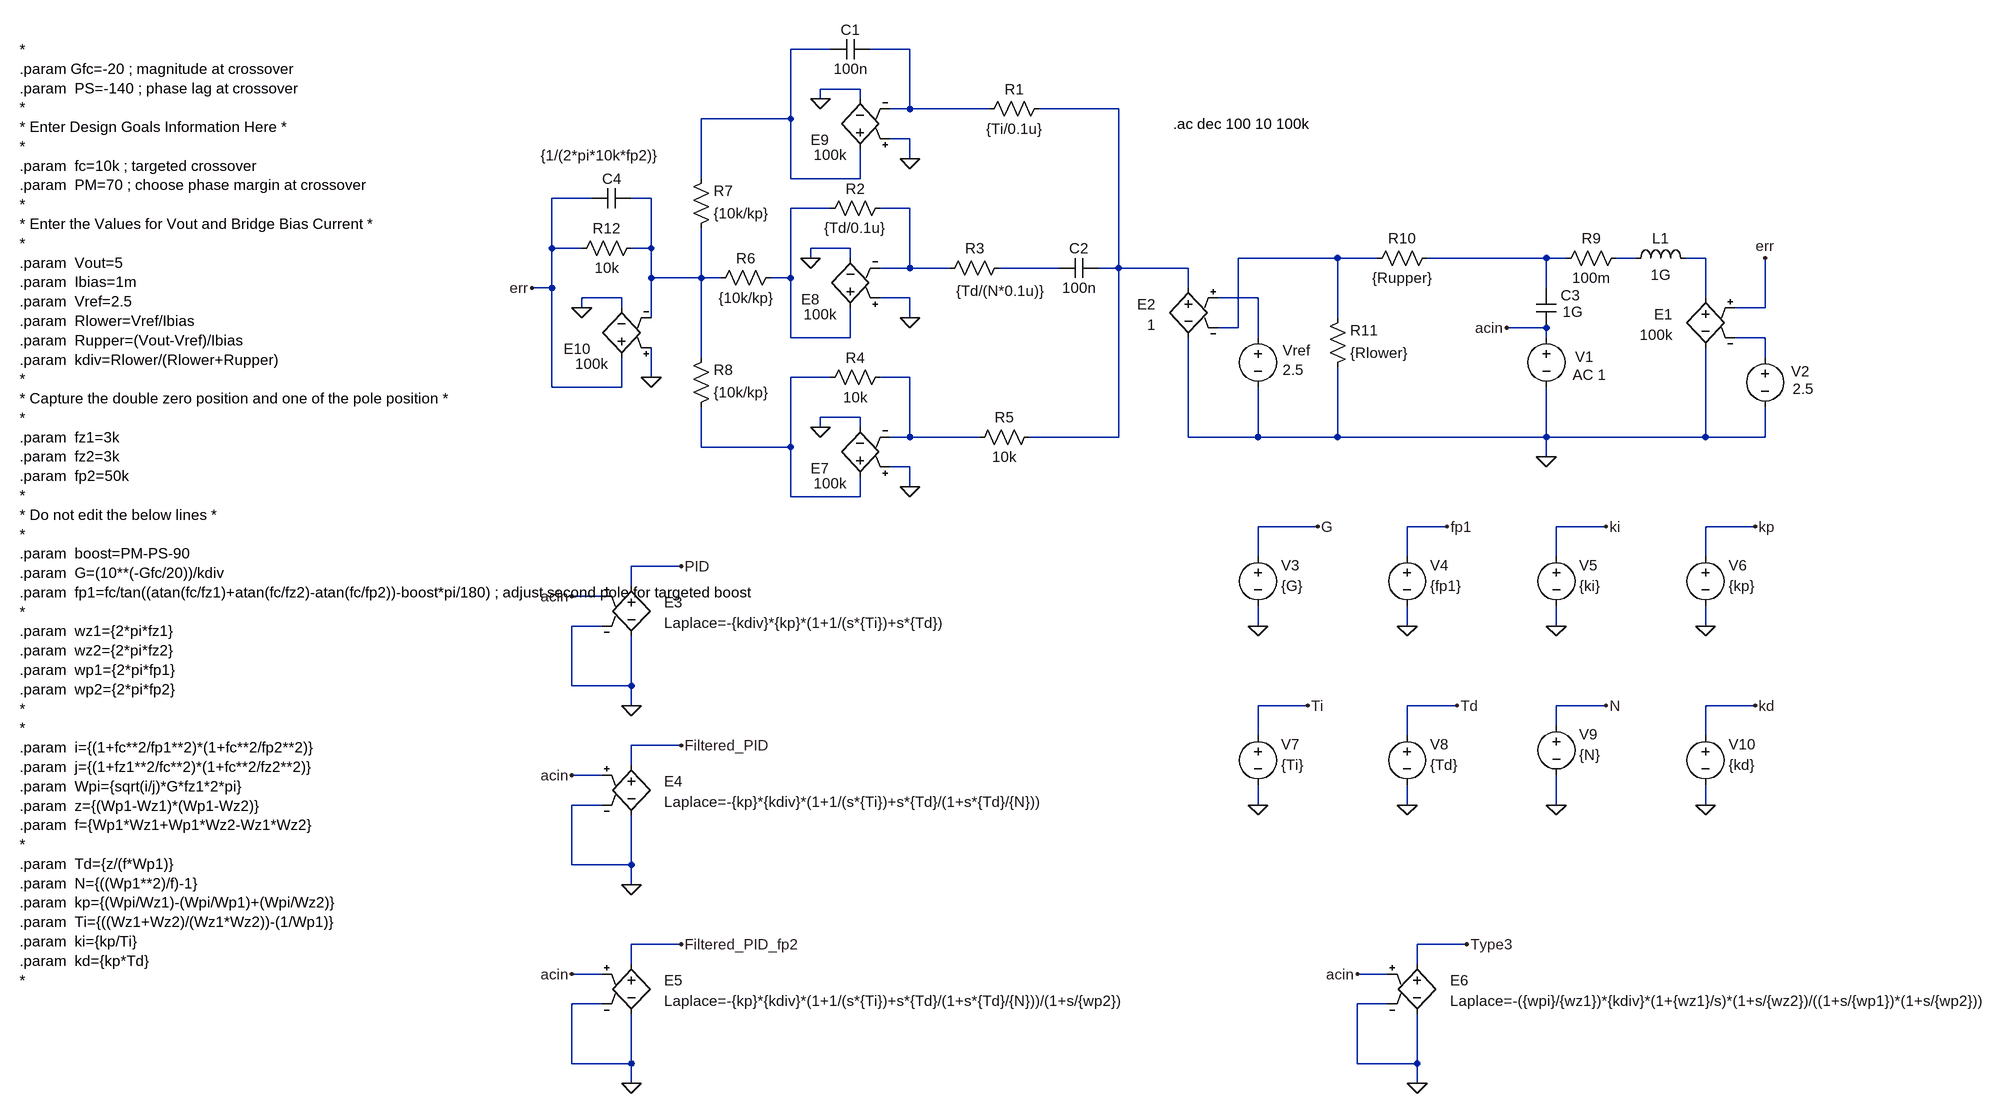
[diagram p0: schematic Filtered PID - E sources.asc]
Filtered PID - E sources.asc, the LTspice schematic file:
Version 4
SHEET 1 2344 2244
WIRE 256 -144 192 -144
WIRE 384 -144 320 -144
WIRE 304 -80 240 -80
WIRE 240 -64 240 -80
WIRE 304 -64 304 -80
WIRE 384 -48 384 -144
WIRE 384 -48 352 -48
WIRE 512 -48 384 -48
WIRE 720 -48 592 -48
WIRE 192 -32 192 -144
WIRE 192 -32 48 -32
WIRE 384 0 352 0
WIRE 384 32 384 0
WIRE 48 64 48 -32
WIRE 192 64 192 -32
WIRE 304 64 304 16
WIRE 304 64 192 64
WIRE -128 96 -192 96
WIRE -32 96 -64 96
WIRE 256 112 192 112
WIRE 384 112 336 112
WIRE -192 176 -192 96
WIRE -144 176 -192 176
WIRE -32 176 -32 96
WIRE -32 176 -64 176
WIRE 288 176 224 176
WIRE 224 192 224 176
WIRE 288 192 288 176
WIRE 1072 192 912 192
WIRE 1136 192 1072 192
WIRE 1408 192 1216 192
WIRE 1440 192 1408 192
WIRE 1552 192 1520 192
WIRE 1664 192 1632 192
WIRE 384 208 384 112
WIRE 384 208 336 208
WIRE 448 208 384 208
WIRE 624 208 528 208
WIRE 720 208 720 -48
WIRE 720 208 688 208
WIRE 832 208 720 208
WIRE -32 224 -32 176
WIRE 48 224 48 144
WIRE 48 224 -32 224
WIRE 80 224 48 224
WIRE 192 224 192 112
WIRE 192 224 160 224
WIRE -192 240 -192 176
WIRE -192 240 -224 240
WIRE 832 240 832 208
WIRE 1408 240 1408 192
WIRE -80 256 -144 256
WIRE 384 256 336 256
WIRE 944 256 880 256
WIRE 1664 256 1664 192
WIRE -144 272 -144 256
WIRE -80 272 -80 256
WIRE 1760 272 1760 192
WIRE 1760 272 1712 272
WIRE -32 288 -32 224
WIRE 384 288 384 256
WIRE 1072 288 1072 192
WIRE 912 304 912 192
WIRE 912 304 880 304
WIRE 1408 304 1344 304
WIRE 192 320 192 224
WIRE 288 320 288 272
WIRE 288 320 192 320
WIRE 944 320 944 256
WIRE 1408 320 1408 304
WIRE 1760 320 1712 320
WIRE 48 352 48 224
WIRE 1760 352 1760 320
WIRE -32 384 -32 336
WIRE 256 384 192 384
WIRE 384 384 336 384
WIRE -192 400 -192 240
WIRE -80 400 -80 352
WIRE -80 400 -192 400
WIRE 304 448 240 448
WIRE 240 464 240 448
WIRE 304 464 304 448
WIRE 384 480 384 384
WIRE 384 480 352 480
WIRE 496 480 384 480
WIRE 720 480 720 208
WIRE 720 480 576 480
WIRE 832 480 832 320
WIRE 944 480 944 400
WIRE 944 480 832 480
WIRE 1072 480 1072 368
WIRE 1072 480 944 480
WIRE 1408 480 1408 400
WIRE 1408 480 1072 480
WIRE 1664 480 1664 336
WIRE 1664 480 1408 480
WIRE 1760 480 1760 432
WIRE 1760 480 1664 480
WIRE 48 496 48 432
WIRE 192 496 192 384
WIRE 192 496 48 496
WIRE 1408 512 1408 480
WIRE 384 528 352 528
WIRE 384 560 384 528
WIRE 192 576 192 496
WIRE 304 576 304 544
WIRE 304 576 192 576
WIRE 1040 624 944 624
WIRE 1248 624 1184 624
WIRE 1504 624 1424 624
WIRE 1744 624 1664 624
WIRE 944 672 944 624
WIRE 1184 672 1184 624
WIRE 1424 672 1424 624
WIRE 1664 672 1664 624
WIRE 16 688 -64 688
WIRE -64 720 -64 688
WIRE -112 736 -160 736
WIRE -112 784 -160 784
WIRE 944 784 944 752
WIRE 1184 784 1184 752
WIRE 1424 784 1424 752
WIRE 1664 784 1664 752
WIRE -160 880 -160 784
WIRE -64 880 -64 800
WIRE -64 880 -160 880
WIRE -64 912 -64 880
WIRE 1024 912 944 912
WIRE 1264 912 1184 912
WIRE 1504 912 1424 912
WIRE 1744 912 1664 912
WIRE 1424 944 1424 912
WIRE 944 960 944 912
WIRE 1184 960 1184 912
WIRE 1664 960 1664 912
WIRE 16 976 -64 976
WIRE -64 1008 -64 976
WIRE -112 1024 -160 1024
WIRE -112 1072 -160 1072
WIRE 944 1072 944 1040
WIRE 1184 1072 1184 1040
WIRE 1424 1072 1424 1024
WIRE 1664 1072 1664 1040
WIRE -160 1168 -160 1072
WIRE -64 1168 -64 1088
WIRE -64 1168 -160 1168
WIRE -64 1200 -64 1168
WIRE 16 1296 -64 1296
WIRE 1280 1296 1200 1296
WIRE -64 1328 -64 1296
WIRE 1200 1328 1200 1296
WIRE -112 1344 -160 1344
WIRE 1152 1344 1104 1344
WIRE -112 1392 -160 1392
WIRE 1152 1392 1104 1392
WIRE -160 1488 -160 1392
WIRE -64 1488 -64 1408
WIRE -64 1488 -160 1488
WIRE 1104 1488 1104 1392
WIRE 1200 1488 1200 1408
WIRE 1200 1488 1104 1488
WIRE -64 1520 -64 1488
WIRE 1200 1520 1200 1488
FLAG -224 240 err
FLAG 1760 192 err
FLAG 1408 512 0
FLAG 1040 624 G
FLAG 944 784 0
FLAG 1248 624 fp1
FLAG 1184 784 0
FLAG 1504 624 ki
FLAG 1424 784 0
FLAG 1744 624 kp
FLAG 1664 784 0
FLAG 1024 912 Ti
FLAG 944 1072 0
FLAG 1264 912 Td
FLAG 1184 1072 0
FLAG 1504 912 N
FLAG 1424 1072 0
FLAG 1744 912 kd
FLAG 1664 1072 0
FLAG 1344 304 acin
FLAG -64 912 0
FLAG 16 688 PID
FLAG -160 736 acin
FLAG -64 1200 0
FLAG 16 976 Filtered_PID
FLAG -160 1024 acin
FLAG -64 1520 0
FLAG 16 1296 Filtered_PID_fp2
FLAG -160 1344 acin
FLAG 1200 1520 0
FLAG 1280 1296 Type3
FLAG 1104 1344 acin
FLAG 240 464 0
FLAG 384 560 0
FLAG 224 192 0
FLAG 240 -64 0
FLAG -144 272 0
FLAG -32 384 0
FLAG 384 32 0
FLAG 384 288 0
DATAFLAG 1328 192 ""
DATAFLAG 944 624 ""
DATAFLAG 1184 624 ""
DATAFLAG 1424 624 ""
DATAFLAG 1664 624 ""
DATAFLAG 976 912 ""
DATAFLAG 1184 912 ""
DATAFLAG 1456 912 ""
DATAFLAG 1664 912 ""
SYMBOL cap 320 -160 R90
WINDOW 0 0 32 VBottom 2
WINDOW 3 32 32 VTop 2
SYMATTR InstName C1
SYMATTR Value 100n
SYMBOL res 608 -64 R90
WINDOW 0 0 56 VBottom 2
WINDOW 3 32 56 VTop 2
SYMATTR InstName R1
SYMATTR Value {Ti/0.1u}
SYMBOL res 352 96 R90
WINDOW 0 0 56 VBottom 2
WINDOW 3 32 56 VTop 2
SYMATTR InstName R2
SYMATTR Value {Td/0.1u}
SYMBOL res 544 192 R90
WINDOW 0 0 56 VBottom 2
WINDOW 3 37 15 VTop 2
SYMATTR InstName R3
SYMATTR Value {Td/(N*0.1u)}
SYMBOL cap 688 192 R90
WINDOW 0 0 32 VBottom 2
WINDOW 3 32 32 VTop 2
SYMATTR InstName C2
SYMATTR Value 100n
SYMBOL res 352 368 R90
WINDOW 0 0 56 VBottom 2
WINDOW 3 32 56 VTop 2
SYMATTR InstName R4
SYMATTR Value 10k
SYMBOL res 592 464 R90
WINDOW 0 0 56 VBottom 2
WINDOW 3 32 56 VTop 2
SYMATTR InstName R5
SYMATTR Value 10k
SYMBOL res 176 208 R90
WINDOW 0 0 56 VBottom 2
WINDOW 3 32 56 VTop 2
SYMATTR InstName R6
SYMATTR Value {10k/kp}
SYMBOL res 32 160 M180
WINDOW 0 36 76 Left 2
WINDOW 3 36 40 Left 2
SYMATTR InstName R7
SYMATTR Value {10k/kp}
SYMBOL res 32 448 M180
WINDOW 0 36 76 Left 2
WINDOW 3 36 40 Left 2
SYMATTR InstName R8
SYMATTR Value {10k/kp}
SYMBOL voltage 944 304 R0
WINDOW 0 40 36 Left 2
WINDOW 3 40 68 Left 2
SYMATTR InstName Vref
SYMATTR Value 2.5
SYMBOL e 1664 240 M0
WINDOW 0 53 42 Left 2
WINDOW 3 53 75 Left 2
SYMATTR InstName E1
SYMATTR Value 100k
SYMBOL ind 1536 208 R270
WINDOW 0 32 56 VTop 2
WINDOW 3 5 56 VBottom 2
SYMATTR InstName L1
SYMATTR Value 1G
SYMBOL res 1536 176 R90
WINDOW 0 0 56 VBottom 2
WINDOW 3 32 56 VTop 2
SYMATTR InstName R9
SYMATTR Value 100m
SYMBOL cap 1392 240 R0
WINDOW 0 39 12 Left 2
WINDOW 3 42 38 Left 2
SYMATTR InstName C3
SYMATTR Value 1G
SYMBOL voltage 1408 304 R0
WINDOW 0 46 47 Left 2
WINDOW 123 42 76 Left 2
WINDOW 39 0 0 Left 0
SYMATTR InstName V1
SYMATTR Value2 AC 1
SYMATTR Value ""
SYMBOL voltage 1760 336 R0
WINDOW 0 42 38 Left 2
WINDOW 3 44 66 Left 2
SYMATTR InstName V2
SYMATTR Value 2.5
SYMBOL res 1232 176 R90
WINDOW 0 0 56 VBottom 2
WINDOW 3 32 56 VTop 2
SYMATTR InstName R10
SYMATTR Value {Rupper}
SYMBOL res 1056 384 M180
WINDOW 0 36 76 Left 2
WINDOW 3 36 40 Left 2
SYMATTR InstName R11
SYMATTR Value {Rlower}
SYMBOL voltage 944 656 R0
WINDOW 0 37 30 Left 2
WINDOW 3 37 63 Left 2
SYMATTR InstName V3
SYMATTR Value {G}
SYMBOL voltage 1184 656 R0
WINDOW 0 37 30 Left 2
WINDOW 3 37 63 Left 2
SYMATTR InstName V4
SYMATTR Value {fp1}
SYMBOL voltage 1424 656 R0
WINDOW 0 37 30 Left 2
WINDOW 3 37 63 Left 2
SYMATTR InstName V5
SYMATTR Value {ki}
SYMBOL voltage 1664 656 R0
WINDOW 0 37 30 Left 2
WINDOW 3 37 63 Left 2
SYMATTR InstName V6
SYMATTR Value {kp}
SYMBOL voltage 944 944 R0
WINDOW 0 37 30 Left 2
WINDOW 3 37 63 Left 2
SYMATTR InstName V7
SYMATTR Value {Ti}
SYMBOL voltage 1184 944 R0
WINDOW 0 37 30 Left 2
WINDOW 3 37 63 Left 2
SYMATTR InstName V8
SYMATTR Value {Td}
SYMBOL voltage 1424 928 R0
WINDOW 0 37 30 Left 2
WINDOW 3 37 63 Left 2
SYMATTR InstName V9
SYMATTR Value {N}
SYMBOL res -48 160 R90
WINDOW 0 0 56 VBottom 2
WINDOW 3 32 56 VTop 2
SYMATTR InstName R12
SYMATTR Value 10k
SYMBOL cap -64 80 R90
WINDOW 0 0 32 VBottom 2
WINDOW 3 -69 53 VTop 2
SYMATTR InstName C4
SYMATTR Value {1/(2*pi*10k*fp2)}
SYMBOL voltage 1664 944 R0
WINDOW 0 37 30 Left 2
WINDOW 3 37 63 Left 2
SYMATTR InstName V10
SYMATTR Value {kd}
SYMBOL e 832 224 M0
WINDOW 0 53 42 Left 2
WINDOW 3 53 75 Left 2
SYMATTR InstName E2
SYMATTR Value 1
SYMBOL e -64 704 R0
WINDOW 0 53 42 Left 2
WINDOW 3 53 75 Left 2
SYMATTR InstName E3
SYMATTR Value Laplace=-{kdiv}*{kp}*(1+1/(s*{Ti})+s*{Td})
SYMBOL e -64 992 R0
WINDOW 0 53 42 Left 2
WINDOW 3 53 75 Left 2
SYMATTR InstName E4
SYMATTR Value Laplace=-{kp}*{kdiv}*(1+1/(s*{Ti})+s*{Td}/(1+s*{Td}/{N}))
SYMBOL e -64 1312 R0
WINDOW 0 53 42 Left 2
WINDOW 3 53 75 Left 2
SYMATTR InstName E5
SYMATTR Value Laplace=-{kp}*{kdiv}*(1+1/(s*{Ti})+s*{Td}/(1+s*{Td}/{N}))/(1+s/{wp2})
SYMBOL e 1200 1312 R0
WINDOW 0 53 42 Left 2
WINDOW 3 53 75 Left 2
SYMATTR InstName E6
SYMATTR Value Laplace=-({wpi}/{wz1})*{kdiv}*(1+{wz1}/s)*(1+s/{wz2})/((1+s/{wp1})*(1+s/{wp2}))
SYMBOL e 304 560 R180
WINDOW 0 50 30 Left 2
WINDOW 3 22 6 Left 2
SYMATTR InstName E7
SYMATTR Value 100k
SYMBOL e 288 288 R180
WINDOW 0 50 30 Left 2
WINDOW 3 22 6 Left 2
SYMATTR InstName E8
SYMATTR Value 100k
SYMBOL e 304 32 R180
WINDOW 0 50 30 Left 2
WINDOW 3 22 6 Left 2
SYMATTR InstName E9
SYMATTR Value 100k
SYMBOL e -80 368 R180
WINDOW 0 50 30 Left 2
WINDOW 3 22 6 Left 2
SYMATTR InstName E10
SYMATTR Value 100k
TEXT -1048 -144 Left 2 !*\n.param Gfc=-20 ; magnitude at crossover\n.param  PS=-140 ; phase lag at crossover\n*\n* Enter Design Goals Information Here *\n*\n.param  fc=10k ; targeted crossover\n.param  PM=70 ; choose phase margin at crossover\n*\n* Enter the Values for Vout and Bridge Bias Current *\n*\n.param  Vout=5\n.param  Ibias=1m\n.param  Vref=2.5\n.param  Rlower=Vref/Ibias\n.param  Rupper=(Vout-Vref)/Ibias\n.param  kdiv=Rlower/(Rlower+Rupper)\n*\n* Capture the double zero position and one of the pole position *\n*\n.param  fz1=3k\n.param  fz2=3k\n.param  fp2=50k\n*\n* Do not edit the below lines *\n*\n.param  boost=PM-PS-90\n.param  G=(10**(-Gfc/20))/kdiv\n.param  fp1=fc/tan((atan(fc/fz1)+atan(fc/fz2)-atan(fc/fp2))-boost*pi/180) ; adjust second pole for targeted boost\n*\n.param  wz1={2*pi*fz1}\n.param  wz2={2*pi*fz2}\n.param  wp1={2*pi*fp1}\n.param  wp2={2*pi*fp2}\n*\n*\n.param  i={(1+fc**2/fp1**2)*(1+fc**2/fp2**2)}\n.param  j={(1+fz1**2/fc**2)*(1+fc**2/fz2**2)}\n.param  Wpi={sqrt(i/j)*G*fz1*2*pi}\n.param  z={(Wp1-Wz1)*(Wp1-Wz2)}\n.param  f={Wp1*Wz1+Wp1*Wz2-Wz1*Wz2}\n*\n.param  Td={z/(f*Wp1)}\n.param  N={((Wp1**2)/f)-1}\n.param  kp={(Wpi/Wz1)-(Wpi/Wp1)+(Wpi/Wz2)}\n.param  Ti={((Wz1+Wz2)/(Wz1*Wz2))-(1/Wp1)}\n.param  ki={kp/Ti}\n.param  kd={kp*Td}\n*
TEXT 808 -24 Left 2 !.ac dec 100 10 100k

The netlist it stands for:
* Filtered PID - E sources.asc
C1 N002 N001 100n
R1 N003 N002 {Ti/0.1u}
R2 N006 N005 {Td/0.1u}
R3 N011 N006 {Td/(N*0.1u)}
C2 N003 N011 100n
R4 N015 N014 10k
R5 N003 N015 10k
R6 N005 N004 {10k/kp}
R7 N004 N001 {10k/kp}
R8 N014 N004 {10k/kp}
Vref N012 0 2.5
E1 N010 0 err N013 100k
L1 N009 N010 1G
R9 N009 N008 100m
C3 N008 acin 1G
V1 acin 0 AC 1
V2 N013 0 2.5
R10 N008 N007 {Rupper}
R11 0 N007 {Rlower}
V3 G 0 {G}
V4 fp1 0 {fp1}
V5 ki 0 {ki}
V6 kp 0 {kp}
V7 Ti 0 {Ti}
V8 Td 0 {Td}
V9 N 0 {N}
R12 N004 err 10k
C4 N004 err {1/(2*pi*10k*fp2)}
V10 kd 0 {kd}
E2 N003 0 N012 N007 1
E3 PID 0 acin 0 Laplace=-{kdiv}*{kp}*(1+1/(s*{Ti})+s*{Td})
E4 Filtered_PID 0 acin 0 Laplace=-{kp}*{kdiv}*(1+1/(s*{Ti})+s*{Td}/(1+s*{Td}/{N}))
E5 Filtered_PID_fp2 0 acin 0 Laplace=-{kp}*{kdiv}*(1+1/(s*{Ti})+s*{Td}/(1+s*{Td}/{N}))/(1+s/{wp2})
E6 Type3 0 acin 0 Laplace=-({wpi}/{wz1})*{kdiv}*(1+{wz1}/s)*(1+s/{wz2})/((1+s/{wp1})*(1+s/{wp2}))
E7 N014 0 0 N015 100k
E8 N005 0 0 N006 100k
E9 N001 0 0 N002 100k
E10 err 0 0 N004 100k
*
.param Gfc=-20 ; magnitude at crossover
.param  PS=-140 ; phase lag at crossover
*
* Enter Design Goals Information Here *
*
.param  fc=10k ; targeted crossover
.param  PM=70 ; choose phase margin at crossover
*
* Enter the Values for Vout and Bridge Bias Current *
*
.param  Vout=5
.param  Ibias=1m
.param  Vref=2.5
.param  Rlower=Vref/Ibias
.param  Rupper=(Vout-Vref)/Ibias
.param  kdiv=Rlower/(Rlower+Rupper)
*
* Capture the double zero position and one of the pole position *
*
.param  fz1=3k
.param  fz2=3k
.param  fp2=50k
*
* Do not edit the below lines *
*
.param  boost=PM-PS-90
.param  G=(10**(-Gfc/20))/kdiv
.param  fp1=fc/tan((atan(fc/fz1)+atan(fc/fz2)-atan(fc/fp2))-boost*pi/180) ; adjust second pole for targeted boost
*
.param  wz1={2*pi*fz1}
.param  wz2={2*pi*fz2}
.param  wp1={2*pi*fp1}
.param  wp2={2*pi*fp2}
*
*
.param  i={(1+fc**2/fp1**2)*(1+fc**2/fp2**2)}
.param  j={(1+fz1**2/fc**2)*(1+fc**2/fz2**2)}
.param  Wpi={sqrt(i/j)*G*fz1*2*pi}
.param  z={(Wp1-Wz1)*(Wp1-Wz2)}
.param  f={Wp1*Wz1+Wp1*Wz2-Wz1*Wz2}
*
.param  Td={z/(f*Wp1)}
.param  N={((Wp1**2)/f)-1}
.param  kp={(Wpi/Wz1)-(Wpi/Wp1)+(Wpi/Wz2)}
.param  Ti={((Wz1+Wz2)/(Wz1*Wz2))-(1/Wp1)}
.param  ki={kp/Ti}
.param  kd={kp*Td}
*
.ac dec 100 10 100k
.backanno
.end